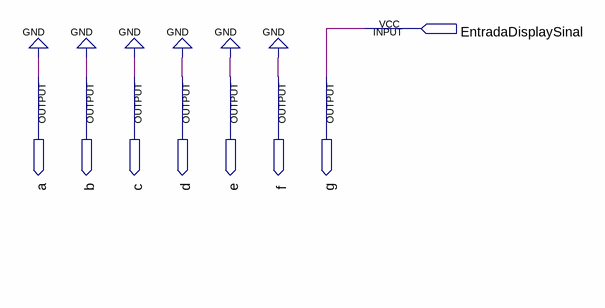
[diagram p0: schematic sheet]
// Quartus schematic DisplaySinal.bdf as structural Verilog: 0 symbols, 8 pins
module DisplaySinal (
  input  EntradaDisplaySinal,
  output a,
  output b,
  output c,
  output d,
  output e,
  output f,
  output g
);


  assign a = 1'b0;
  assign b = 1'b0;
  assign c = 1'b0;
  assign d = 1'b0;
  assign e = 1'b0;
  assign f = 1'b0;
  assign g = EntradaDisplaySinal;
endmodule
